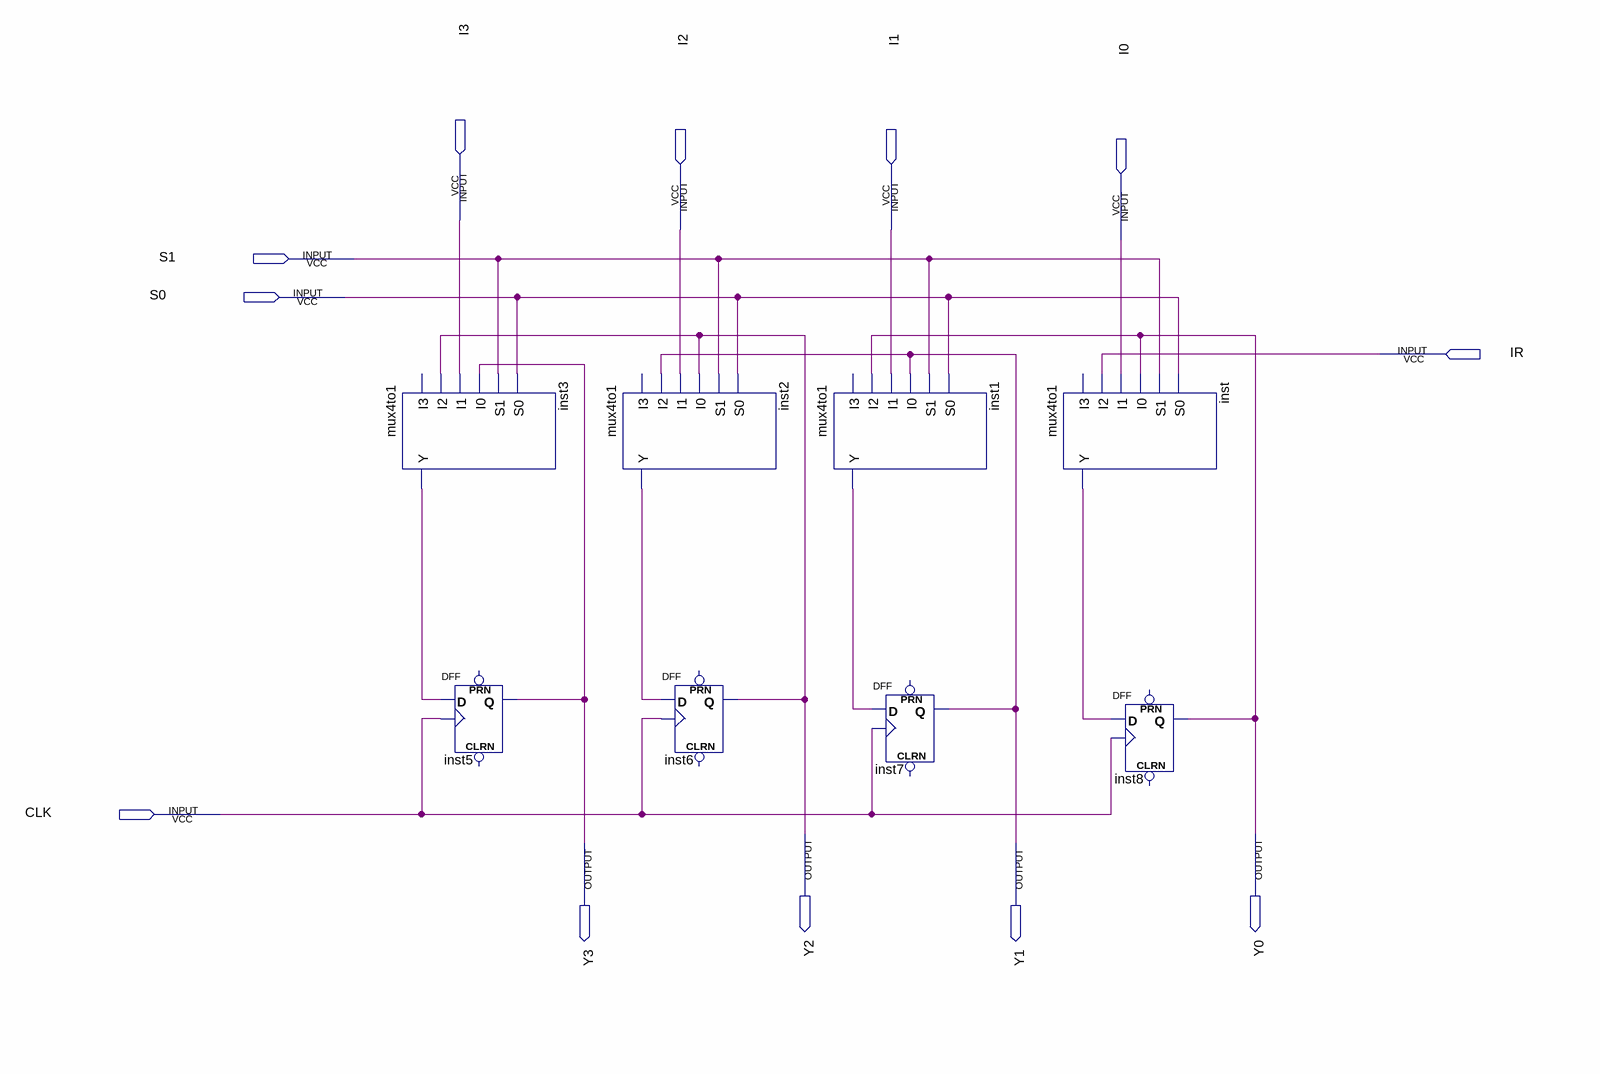
[diagram p0: schematic sheet]
// Quartus schematic SR4bit.bdf as structural Verilog: 8 symbols, 12 pins
module SR4bit (
  input  I3,
  input  I2,
  input  I1,
  input  I0,
  input  S1,
  input  S0,
  input  IR,
  input  CLK,
  output Y2,
  output Y0,
  output Y3,
  output Y1
);

  wire inst1_y, inst2_y, inst3_y, inst_y;

  mux4to1 inst3 (.I2(Y2), .I1(I3), .I0(Y3), .S1(S1), .S0(S0), .Y(inst3_y));  // open: I3
  DFF inst5 (.CLK(CLK), .D(inst3_y), .Q(Y3));  // open: CLRN, PRN
  mux4to1 inst2 (.I2(Y1), .I1(I2), .I0(Y2), .S1(S1), .S0(S0), .Y(inst2_y));  // open: I3
  DFF inst6 (.CLK(CLK), .D(inst2_y), .Q(Y2));  // open: CLRN, PRN
  mux4to1 inst1 (.I2(Y0), .I1(I1), .I0(Y1), .S1(S1), .S0(S0), .Y(inst1_y));  // open: I3
  DFF inst7 (.CLK(CLK), .D(inst1_y), .Q(Y1));  // open: CLRN, PRN
  mux4to1 inst (.I2(IR), .I1(I0), .I0(Y0), .S1(S1), .S0(S0), .Y(inst_y));  // open: I3
  DFF inst8 (.CLK(CLK), .D(inst_y), .Q(Y0));  // open: CLRN, PRN
endmodule
